# EAGLE design GB USB-C Charging Kit Pro (EAGLE 6.2)
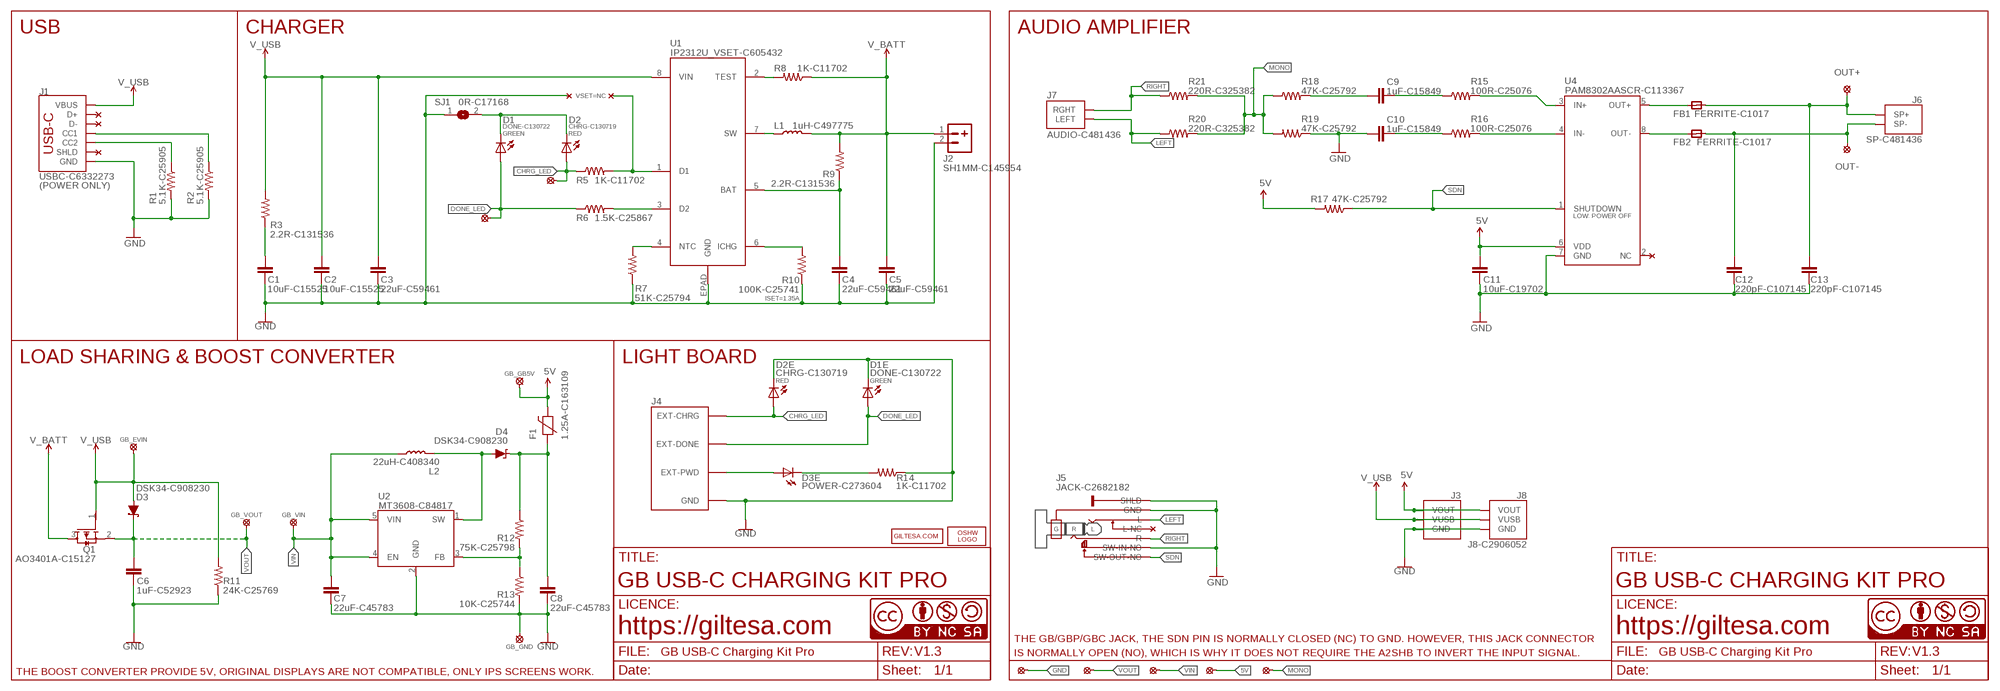
[diagram p0: schematic, sheet 1]

## Parts
C1  10uF-C15525  C0402_S  [C0402_S]
C2  10uF-C15525  C0402_S  [C0402_S]
C3  22uF-C59461  C0603_SMALL  [C0603_S]
C4  22uF-C59461  C0603_SMALL  [C0603_S]
C5  22uF-C59461  C0603_SMALL  [C0603_S]
C6  1uF-C52923  C0402_S  [C0402_S]
C7  22uF-C45783  C0805_SMALL  [C0805_S]
C8  22uF-C45783  C0805_SMALL  [C0805_S]
C9  1uF-C15849  C0603_SMALL  [C0603_S]
C10  1uF-C15849  C0603_SMALL  [C0603_S]
C11  10uF-C19702  C0603_SMALL  [C0603_S]
C12  220pF-C107145  C0805_SMALL  [C0805_S]
C13  220pF-C107145  C0805_SMALL  [C0805_S]
D1  DONE-C130722  LED_0402  [L0402]
D1E  DONE-C130722  LED_0402  [L0402]
D2  CHRG-C130719  LED_0402  [L0402]
D2E  CHRG-C130719  LED_0402  [L0402]
D3  DSK34-C908230  DIODE-SCHOTTKY_SOD-123FL  [SOD-123FL]
D3E  POWER-C273604  LED_0402  [L0402]
D4  DSK34-C908230  DIODE-SCHOTTKY_SOD-123FL  [SOD-123FL]
F1  1.25A-C163109  FUSE0603_S  [F0603_S]
FB1  FERRITE-C1017  MICROBUILDER_FERRITE_SMALL  [MICROBUILDER__0805MP_S]
FB2  FERRITE-C1017  MICROBUILDER_FERRITE_SMALL  [MICROBUILDER__0805MP_S]
GB_  POWER-C2845538  GB_DMG_JST_POWER  [GB_DMG_JST_POWER]
GBL_  LED-C481436  GB_DMG_JST_LED  [GB_DMG_JST_LED]
J1  USBC-C6332273  USB-C_16P_DADA_3MM  [USB-C_16P_3MM]
J2  SH1MM-C145954  JST-21MM  [JST-2-1MM-SMD_RIGHT]
J3  GB_DMG_BRIDGE_2.0MM_UP  [GB_DMG_BRIDGE_2.0MM_UP]
J4  GB_DMG_LED  [GB_DMG_LED]
J5  JACK-C2682182  GB_DMG_JACK  [GB_DMG_JACK]
J6  SP-C481436  GB_DMG_JST_SPEAKER  [GB_DMG_JST_SPEAKER]
J7  AUDIO-C481436  GB_DMG_JST_AUDIO  [GB_DMG_JST_AUDIO]
J8  J8-C2906052  GB_DMG_BRIDGE_2.0MM_RIGHT  [GB_DMG_BRIDGE_2.0MM_RIGHT]
L1  1uH-C497775  INDUCTOR_2  [PSPMAA0402]
L2  22uH-C408340  INDUCTOR_2  [PSPMAA0402]
LOGO2  OSHW_LOGO_FILLX0150-NT  [OSHW_FILLX150_NOTEXT]
PP1  SOLDER_PAD-1.3  [SOLDER_PAD_1.3]
PP2  SOLDER_PAD-1.3  [SOLDER_PAD_1.3]
PP3  SOLDER_PAD-1.3  [SOLDER_PAD_1.3]
PP4  SOLDER_PAD-1.3  [SOLDER_PAD_1.3]
PP6  SOLDER_PAD-1.3  [SOLDER_PAD_1.3]
Q1  AO3401A-C15127  AO3401A_SMALL  [SOT23-3_S]
R1  5.1K-C25905  R0402  [R0402]
R2  5.1K-C25905  R0402  [R0402]
R3  2.2R-C131536  R0402  [R0402]
R5  1K-C11702  R0402  [R0402]
R6  1.5K-C25867  R0402  [R0402]
R7  51K-C25794  R0402  [R0402]
R8  1K-C11702  R0402  [R0402]
R9  2.2R-C131536  R0402  [R0402]
R10  100K-C25741  R0402  [R0402]
R11  24K-C25769  R0402  [R0402]
R12  75K-C25798  R0402  [R0402]
R13  10K-C25744  R0402  [R0402]
R14  1K-C11702  R0402  [R0402]
R15  100R-C25076  R0402  [R0402]
R16  100R-C25076  R0402  [R0402]
R17  47K-C25792  R0402  [R0402]
R18  47K-C25792  R0402  [R0402]
R19  47K-C25792  R0402  [R0402]
R20  220R-C325382  R0402  [R0402]
R21  220R-C325382  R0402  [R0402]
SJ1  0R-C17168  JUMPER-SMD0402  [JUMPER-SMD_0402]
U1  IP2312U_VSET-C605432  IP2312_CUSTOM  [IP2312]
U2  MT3608-C84817  MT3608"  [SOT-23-6]
U4  PAM8302AASCR-C113367  PAM8302A_ASCR  [PAM8302AASCR]
U$6  CC-BY-NC-SA15MM  [CC-BY-NC-SA_15MM]
U$16  GILTESA.COM_MASK  [GILTESA.COM_MASK_15MM]
U$17  CC-NC-BCNIX  [CC-NC-B_NIX]
U$20  OUT+  SOLDER_PAD-1.3  [SOLDER_PAD_1.3]
U$21  CC-NC-BCNIX  [CC-NC-B_NIX]
U$23  OUT-  SOLDER_PAD-1.3  [SOLDER_PAD_1.3]

## Nets
5V: C11.1 F1.2 GB_.GB5V J3.VOUT J8.VOUT PP1.P$1 R17.2 U4.6(VDD)
CHRG_LED: D2.A D2E.A GBL_.CHRG J4.EXT-CHRG R5.1
DONE_LED: D1.A D1E.A GBL_.DONE J4.EXT-DONE R6.1
GND: C1.1 C2.1 C3.1 C4.1 C5.1 C6.2 C7.1 C8.1 C10.2 C11.2 C12.2 C13.2 D1E.C D2E.C GB_.GND J1.GND1(GND) J1.GND2(GND) J2.2 J3.GND J4.PWD-GND'(GND) J4.PWD-GND(GND) J5.1"(GND) J5.1(GND) J5.5(SW-IN-NO) J5.8'(SHLD) J5.8(SHLD) J8.GND PP2.P$1 R1.2 R2.2 R7.1 R10.1 R11.1 R13.2 R14.1 R19.1 SJ1.1 U1.EPAD(GND) U2.2(GND) U4.7(GND)
LEFT: J5.3(L) J7.LEFT R20.1
MONO: PP6.P$1 R18.1 R19.2 R20.2 R21.2
N$1: D1.C D2.C SJ1.2
N$2: C8.2 D4.C F1.1 R12.1
N$3: D4.A L2.P$2 U2.1(SW)
N$4: J1.B5-CC2(CC2) R1.1
N$6: R8.2 U1.2(TEST)
N$7: R12.2 R13.1 U2.3(FB)
N$9: R16.2 U4.4(IN-)
N$10: D3E.A J4.EXT-PWD
N$11: D3E.C R14.2
N$12: R15.2 U4.3(IN+)
N$13: J1.A5-CC1(CC1) R2.1
N$14: C4.2 R9.1 U1.5(BAT)
N$15: C1.2 R3.1
N$16: C10.1 R16.1
N$17: FB2.1 U4.8(OUT-)
N$19: R5.2 U1.1(D1)
N$22: FB1.1 U4.5(OUT+)
N$23: C9.1 R15.1
N$25: C9.2 R18.2
N$27: R7.2 U1.4(NTC)
N$28: R10.2 U1.6(ICHG)
N$29: R6.2 U1.3(D2)
N$31: L1.P$1 U1.7(SW)
OUT+: C13.1 FB1.2 J6.SP+ U$20.P$1
OUT-: C12.1 FB2.2 J6.SP- U$23.P$1
RIGHT: J5.2(R) J7.RGHT R21.1
SDN: J5.6(SW-OUT-NO) R17.1 U4.1(SHUTDOWN)
V_BATT: C5.2 J2.1 L1.P$2 Q1.3(D) R8.1 R9.2
V_USB: C2.2 C3.2 D3.A GB_.EVIN J1.VBUS1(VBUS) J1.VBUS2(VBUS) J3.VUSB J8.VUSB Q1.1(G) R3.2 R11.2 U1.8(VIN)
VIN: C7.2 GB_.VIN L2.P$1 PP3.P$1 U2.4(EN) U2.5(VIN)
VOUT: C6.1 D3.C GB_.VOUT PP4.P$1 Q1.2(S)
Unconnected: J1.A6-DP1(D+) J1.A7-DN1(D-) J1.B6-DP2(D+) J1.B7-DN2(D-) J1.SHLD1(SHLD) J1.SHLD2(SHLD) J1.SHLD3(SHLD) J1.SHLD4(SHLD) J5.4(L-NC) U4.2(NC)

## Notes on the sheet
- USB | CHARGER | AUDIO AMPLIFIER
- VSET=NC
- GREEN | RED
- (POWER ONLY)
- ISET=1.35A
- LOAD SHARING & BOOST CONVERTER | LIGHT BOARD
- RED | GREEN
- GB USB-C CHARGING KIT PRO | GB USB-C CHARGING KIT PRO
- https://giltesa.com | https://giltesa.com
- THE GB/GBP/GBC JACK, THE SDN PIN IS NORMALLY CLOSED (NC) TO GND. HOWEVER, THIS JACK CONNECTOR
- V1.3 | IS NORMALLY OPEN (NO), WHICH IS WHY IT DOES NOT REQUIRE THE A2SHB TO INVERT THE INPUT SIGNAL. | V1.3
- THE BOOST CONVERTER PROVIDE 5V, ORIGINAL DISPLAYS ARE NOT COMPATIBLE, ONLY IPS SCREENS WORK.

## Library data of the parts
C1 C2 C6 = ,giltesa:C0402
C3-C5 C9-C11 = ,giltesa:C0603
C7 C8 C12 C13 = ,giltesa:C0805
D1 D1E D2 D2E D3E = ,giltesa:LED
D3 D4 = ,giltesa:DIODE-SCHOTTKY
F1 = ,giltesa:FUSE
FB1 FB2 = microbuilder:MICROBUILDER_FERRITE: Ferrite Bead 0603 MMZ1608B121C - 120 Ohm @ 100MHz, 600mA, 0.15 Ohm DC Resistance - Digikey: 445-2164-1-ND BK1608HW121-T - 120 Ohm, 600mA Ferrite Chip - Digikey: 587-1876-2-ND 0805 HZ0805B272R-10 - 2.7K Ohm @ 100MHz, 200mA, 0.8 Ohm DC Resistance - Digikey: 240-2504-1-ND (see also Murata BLM21BD272SN1L) MMZ2012Y152B - 1.5K Ohm @ 100MHz, 500mA, 0.4 Ohm DC Resistance - Digikey: 445-1560-1-ND - Mainly for high frequency (80-400MHz) MMZ2012R102A - 1K Ohm @ 100MHz, 500mA, 0.3 Ohm DC Resistance - Digikey: 445-1555-2-ND - More general purpose (10-200MHz)
GB_ = ,giltesa:GB_DMG_JST_POWER
GBL_ = ,giltesa:GB_DMG_JST_LED
J1 = ,giltesa:USB-C_16P
J2 = ,giltesa:JST-2
J3 J8 = ,giltesa:GB_DMG_BRIDGE
J4 = ,giltesa:GB_DMG_LED
J5 = ,giltesa:GB_DMG_JACK
J6 = ,giltesa:GB_DMG_JST_SPEAKER
J7 = ,giltesa:GB_DMG_JST_AUDIO
L1 L2 = ,giltesa:INDUCTOR
LOGO2 = ohw-logo:OSHW_LOGO_FILL
PP1-PP4 PP6 U$20 U$23 = ,giltesa:SOLDER_PAD
Q1 = ,giltesa:AO3401A
R1-R3 R5-R21 = ,giltesa:R0402
SJ1 = ,giltesa:JUMPER-SMD
U1 = ,giltesa:IP2312
U2 = ,giltesa:MT3608
U4 = ,giltesa:PAM8302A
U$6 = ,giltesa_logos:CC-BY-NC-SA
U$16 = ,giltesa_logos:GILTESA.COM
U$17 U$21 = cc-by-nc-sa:CC-NC-BC: All hardware is licensed under the Creative Commons Attribution-Noncommercial-Share Alike 2.5 Switzerland License. To view a copy of this license, visit http://creativecommons.org/licenses/by-nc-sa/2.5/ch/ or send a letter to Creative Commons, 171 Second Street, Suite 300, San Francisco, California, 94105, USA.

## Net classes
1 power: width 0.61 mm, drill 0.406 mm, clearance 0.203 mm
2 gnd: width 0.305 mm, drill 0.406 mm, clearance 0.203 mm
3 power usb: width 0.508 mm, drill 0.406 mm, clearance 0.203 mm

## Board
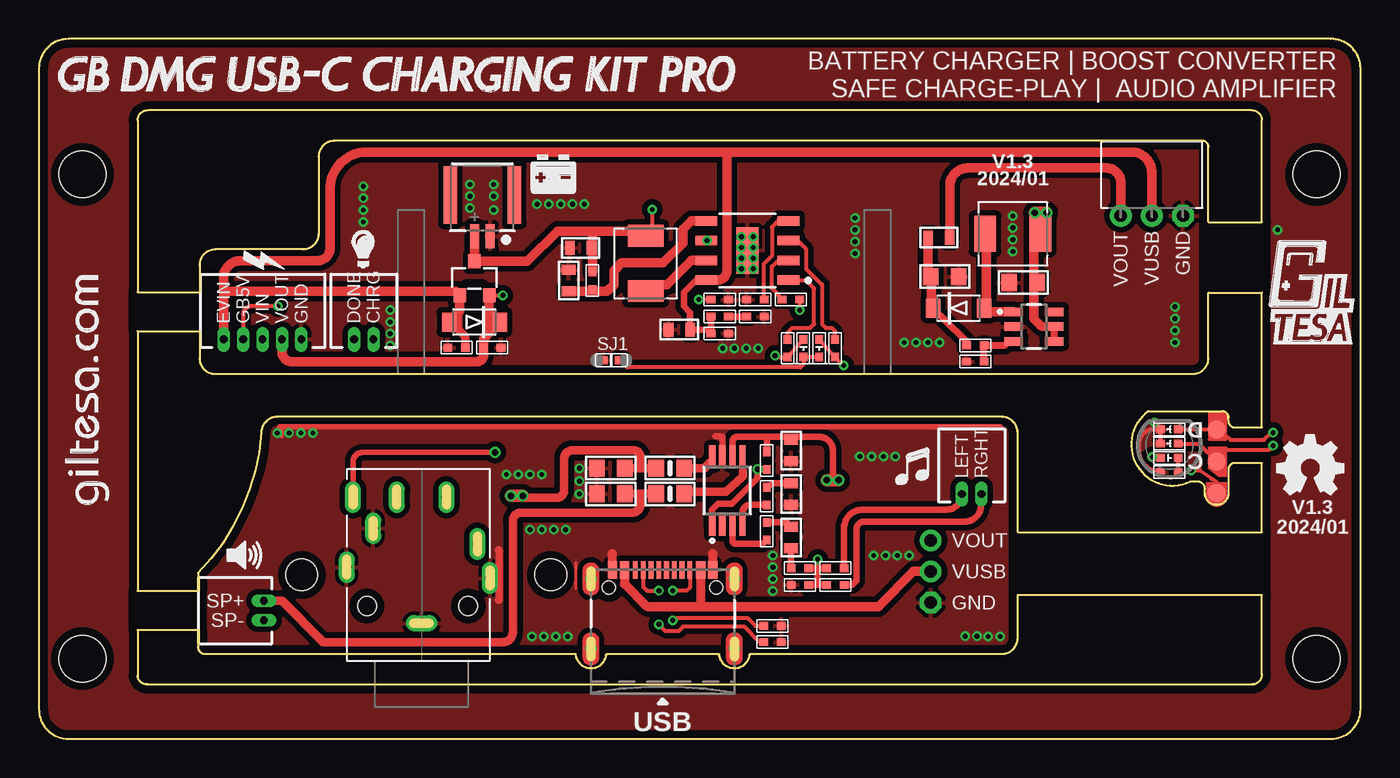
[diagram p1: board, top side]
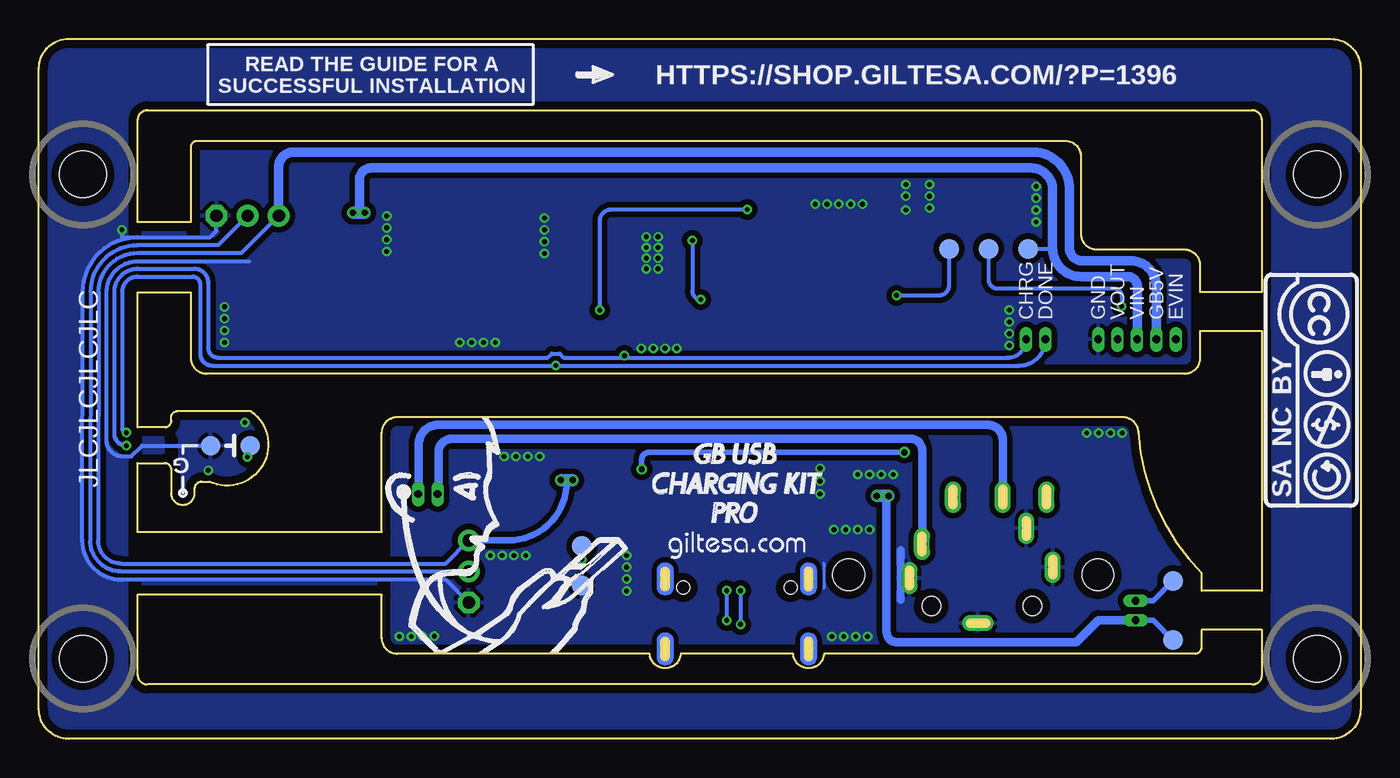
[diagram p2: board, bottom side, seen from below]

Size 85 x 45 mm. Coordinates in mm from the lower left corner, seen from the top.
Outline: 74.52,16.54 74.03,16.54 arc-170 71.35,21.07 76.12,21.07 arc-90 76.5,20.63 76.5,20.47 arc90 76.87,20.02 78.65,20.02 78.65,28.68 75.21,28.68 75.21,24.48 arc-90 74.2,23.46 11.34,23.46 arc-90 10.33,24.48 10.33,26.21 6.35,26.21 6.35,9.51 10.24,9.51 10.24,10.67 arc40 14.31,19.68 arc-90 15.32,20.7 61.93,20.7 arc-90 62.95,19.68 62.95,13.29 78.65,13.29 78.65,17.73 76.95,17.73 arc90 76.5,17.36 76.5,15.8 arc-180 74.98,15.8 74.98,16.08 arc90 74.52,16.54
Outline: 1.91,0 83.07,0 arc90 85,1.91 85,43.1 arc90 83.07,45 1.91,45 arc90 0,43.1 0,1.91 arc90 1.91,0
Outline: 75.21,33.23 75.21,38.07 arc90 74.83,38.45 19,38.45 arc90 17.99,37.43 17.99,32.48 arc-90 16.97,31.46 11.34,31.46 arc90 10.33,30.45 10.33,28.72 6.35,28.72 6.35,39.77 arc-90 6.99,40.41 78.02,40.41 arc-90 78.65,39.77 78.65,33.23 75.21,33.23
Outline: 10.24,7 10.24,5.97 arc90 10.62,5.46 34.5,5.46 arc170 36.5,5.46 43.72,5.46 arc170 45.72,5.46 61.93,5.46 arc90 62.95,6.48 62.95,9.25 78.65,9.25 78.65,4.13 arc-90 78.02,3.5 6.99,3.5 arc-90 6.35,4.06 6.35,7 10.24,7
Copper layers (1*16): Top 0.035mm / dielectric 1.6mm / Bottom 0.035mm
Design rules: minimum track width 6mil, minimum drill 12mil, track to track 6mil, track to pad 6mil, pad to pad 6mil, via to via 8mil, smd to smd 0mil, copper to edge 20mil, drill to drill 10mil, minimum pad ring 6mil, minimum via ring 6mil, stop-mask expansion 0mil, vias tented up to drill 100mil, thermal gap 10mil
Holes 3 mm at 82.17,36.29 2.8,36.29 2.8,5.16 82.17,5.16
tKeepout: area 22.8,23.5 to 25,38.4; area 52.8,23.5 to 55,38.4
tRestrict: 11 lines
bRestrict: 10 lines

### Footprints (pad centres in the part's own frame; a part is rotated, then mirrored left to right if it is on the bottom)
C0402_S = smd 0.559 x 0.5: 1 -0.567,0; 2 0.567,0
C0603_S = smd 0.635 x 0.9: 1 -0.694,0; 2 0.694,0
C0805_S = smd 1 x 1.1: 1 -0.901,0; 2 0.901,0
L0402 = smd 0.559 x 0.5: A 0.567,0; C -0.567,0
SOD-123FL = smd 0.91 x 1.22: A 1.637,0; C -1.637,0
F0603_S = smd 0.635 x 0.9: 1 -0.694,0; 2 0.694,0
MICROBUILDER__0805MP_S = smd 1 x 1.1: 1 -0.901,0; 2 0.901,0
GB_DMG_JST_POWER = drill 0.5 long: EVIN 2.5,0; GB5V 1.25,0; GND -2.5,0; VIN 0,0; VOUT -1.25,0 | smd 0.127 x 0.127: NA 2.5,-0.256
GB_DMG_JST_LED = drill 0.5 long: CHRG -0.625,0; DONE 0.625,0 | smd 0.127 x 0.127: NA 0.625,-0.256
USB-C_16P_3MM = smd 0.3 x 1.143: A5-CC1 -1.25,2.732; A6-DP1 -0.25,2.732; A7-DN1 0.25,2.732; A8-SBU1 1.25,2.732; B5-CC2 1.75,2.732; B6-DP2 0.75,2.732; B7-DN2 -0.75,2.732; B8-SBU2 -1.75,2.732 | smd 0.6 x 1.143: GND1 -3.225,2.732; GND2 3.225,2.732; VBUS1 -2.45,2.732; VBUS2 2.45,2.732 | drill 0.4 pad 0.6: SHLD1 -4.61,2.16; SHLD2 4.61,2.16; SHLD3 -4.61,-2.34; SHLD4 4.61,-2.34 | hole 0.838: -3.45,1.6; 3.45,1.6
JST-2-1MM-SMD_RIGHT = smd 0.6 x 1.524: 1 -0.5,-2.017; 2 0.5,-2.017 | smd 0.889 x 3.683: NC1 -2.054,0.635; NC2 2.054,0.635
GB_DMG_BRIDGE_2.0MM_UP = drill 0.8 pad 1.397 octagon: GND 2,0 | smd 0.127 x 0.127: NA -2,0.256 | drill 0.8 pad 1.397: VOUT -2,0; VUSB 0,0
GB_DMG_LED = smd 1.143 x 1.143: EXT-CHRG -3.048,1.016; EXT-DONE -3.048,-1.016; PWD-GND' -3.048,3.048 | smd 1.27 x 1.27 bottom: EXT-PWD 1.27,0; PWD-GND -1.27,0
GB_DMG_JACK = drill 0.6 pad 1.016 long: 1 0,2.4; 2 -1.6,10.5; 3 3.6,7.5; 4 1.6,10.5; 5 -3.1,8.5; 6 -4.4,10.5; 8 4.4,5.3; 8' -4.8,6 | smd 0.127 x 0.127: 1" 0,2.796 | hole 2.032: -7.704,5.512; 8.311,5.512 | hole 1.2: -3.5,3.5; 3,3.5
GB_DMG_JST_SPEAKER = smd 0.127 x 0.127: NA 0.625,-0.256 | drill 0.5 long: SP+ -0.625,0; SP- 0.625,0
GB_DMG_JST_AUDIO = drill 0.5 long: LEFT 0.625,0; RGHT -0.625,0 | smd 0.127 x 0.127: NA 0.625,-0.256
GB_DMG_BRIDGE_2.0MM_RIGHT = drill 0.8 pad 1.397 octagon: GND -2,0 | smd 0.127 x 0.127: NA 2,-0.256 | drill 0.8 pad 1.397: VOUT 2,0; VUSB 0,0
PSPMAA0402 = smd 1.4 x 2.3: P$1 -1.775,0; P$2 1.775,0
SOLDER_PAD_1.3 = smd 1.3 x 1.3: P$1 0,0
SOT23-3_S = smd 0.8 x 0.9: 1 -0.95,-1.076; 2 0.95,-1.076; 3 0,1.1
R0402 = smd 0.559 x 0.5: 1 -0.567,0; 2 0.567,0
JUMPER-SMD_0402 = smd 0.635 x 0.5: 1 -0.559,0; 2 0.559,0
IP2312 = smd 1.4 x 0.6: 1 -2.65,1.905; 2 -2.65,0.635; 3 -2.65,-0.635; 4 -2.65,-1.905; 5 2.65,-1.905; 6 2.65,-0.635; 7 2.65,0.635; 8 2.65,1.905 | smd 1.4 x 3: EPAD 0,0
SOT-23-6 = smd 0.55 x 1.2: 1 -0.95,-1.3; 2 0,-1.3; 3 0.95,-1.3; 4 0.95,1.3; 5 0,1.3; 6 -0.95,1.3
PAM8302AASCR = smd 0.4 x 1.4: 1 -0.975,-2.2; 2 -0.325,-2.2; 3 0.325,-2.2; 4 0.975,-2.2; 5 0.975,2.2; 6 0.325,2.2; 7 -0.325,2.2; 8 -0.975,2.2

### Placement (x,y rotation side)
C1  46.07,27.15 180 top
C2  43.78,26.07 180 top
C3  41.19,26.32 0 top
C4  34.07,29.47 270 top
C5  34.84,31.57 0 top
C6  29.15,25.15 0 top
C7  63.3,29.34 0 top
C8  58.26,29.72 180 top
C9  48.37,12.95 270 top
C10  48.37,15.75 270 top
C11  48.37,18.54 270 top
C12  36.78,17.41 180 top
C13  36.78,15.76 180 top
D1  50.18,25.11 90 top
D1E  72.69,19.9 0 top
D2  49.16,25.11 90 top
D2E  72.69,18.98 0 top
D3  28.01,26.8 180 top
D3E  72.69,18.07 180 top
D4  59.15,27.69 0 top
F1  57.88,32.22 0 top
FB1  40.59,15.76 180 top
FB2  40.59,17.41 180 top
GB_  14.38,25.68 180 top
GBL_  20.89,25.68 180 top
J1  40.11,8.13 0 top
J2  28.52,34.33 0 top
J3  57.36,10.76 270 top
J4  72.69,18.86 180 top
J5  24.61,5.04 0 top
J6  14.48,8.26 270 top
J7  59.98,15.74 180 top
J8  71.57,33.63 180 top
L1  39.03,30.57 90 top
L2  62.63,32.47 180 top
LOGO2  79.63,15.71 0 top
PP1  23.92,31.5 0 bottom
PP2  50.08,9.86 0 bottom
PP3  21.38,31.5 0 bottom
PP4  26.46,31.5 0 bottom
PP6  50.08,12.4 0 bottom
Q1  28.01,29.59 0 top
R1  47.18,7.27 0 top
R2  47.18,6.23 0 top
R3  43.78,27.15 180 top
R5  48.15,25.11 90 top
R6  51.2,25.11 90 top
R7  46.07,28.24 0 top
R8  48.36,28.24 180 top
R9  35.6,29.47 90 top
R10  43.78,28.24 180 top
R11  26.87,25.15 0 top
R12  60.22,25.3 0 top
R13  60.22,24.26 180 top
R14  72.69,17.16 0 top
R15  46.81,13.35 270 top
R16  46.81,15.61 270 top
R17  46.81,17.89 90 top
R18  48.95,10.98 180 top
R19  48.95,9.89 0 top
R20  51.22,10.98 180 top
R21  51.22,9.89 180 top
SJ1  36.82,24.34 0 top
U1  45.56,31.4 180 top
U2  63.99,26.5 270 top
U4  44.27,15.97 0 top
U$1  [SPEAKER]  12.7,11.81 0 top
U$4  [BATTERY]  31.56,35.05 0 top
U$6  6.22,29.97 270 bottom
U$7  [GAME_BOY_DMG]  1.3,41.57 0 top
U$8  [LIGHT]  20.07,30.23 0 top
U$9  [GILTESA_LOGO_MASK_7MM]  78.49,25.27 0 top
U$10  [SOUND]  54.99,16.26 0 top
U$13  [GB_DMG_BOARD_LOGO]  62.76,5.46 0 bottom
U$14  [POWER]  13.08,29.97 0 top
U$15  [GILTESA.COM_MASK_9MM]  40.11,12.45 0 bottom
U$16  4.62,14.96 90 top
U$17  0,0 0 top
U$20  12.06,10.16 0 bottom
U$21  0,0 0 top
U$23  12.06,6.35 0 bottom
U$34  [GB_DMG_BOARD]  40.11,16.45 0 bottom

### Tracks (layer width: path | path; a pad name or v marks a point on that pad's centre or on a via)
5V  (via drill 0.3, 0.41)
  Top 0.254: v15.37,27.81 13.64,27.81 arc90 13.13,27.3 GB_.GB5V
  Top 0.406: U4.6 44.6,19.11 arc-90 44.91,19.42 46.94,19.42 | 46.94,19.42 46.81,19.29 R17.2 | v51.44,16.64 51.05,16.64 | 48.43,19.18 C11.1 48.37,19.4 48.39,19.42 | 46.94,19.42 48.39,19.42 | 48.39,19.42 50.18,19.42 arc-90 51.05,18.54 51.05,16.64 | 51.05,16.64 v50.67,16.64
  Top 0.61: F1.2 58.57,35.52 arc-90 59.75,36.7 68.65,36.7 arc-90 69.57,35.78 J8.VOUT
  Top 0.813: v51.44,16.64 v50.67,16.64
  Bottom 0.254: J8.VOUT 71.96,31.24 78.65,31.24 arc-90 81.15,28.74 81.19,12.74 arc-90 79.71,11.27 58.85,11.27 J3.VOUT | 15.37,28.07 v15.37,27.81 15.37,28.45 arc-90 15.88,28.96 23.37,28.96 arc90 23.92,29.51 PP1.P$1
  Bottom 0.406: J3.VOUT 54.8,12.76 arc-90 51.05,16.51 51.05,16.64 v50.67,16.64
  Bottom 0.61: J8.VOUT 69.57,36.78 arc90 68.64,37.72 21.02,37.72 arc90 18.73,35.31 18.73,31.56 arc-90 17.91,30.73 14.78,30.73 arc90 13.13,29.08 GB_.GB5V
  Bottom 0.813: v50.67,16.64 v51.44,16.64
CHRG_LED  (via drill 0.3)
  Top 0.254: D2E.A 74.6,18.98 J4.EXT-CHRG 76.38,18.59 79.12,18.59 v79.38,18.85 | D2.A R5.1 48.11,24.51 47.47,24.51 v47.34,24.64
  Bottom 0.254: v79.38,18.85 arc90 80.14,19.61 80.14,28.74 arc90 78.65,30.23 75,30.23 arc90 74.11,29.34 74.11,25.15 arc-90 73.48,24.51 52.27,24.51 52.01,24.77 51.51,24.77 51.25,24.51 47.47,24.51 v47.34,24.64 47.34,24.61 47.24,24.51 22.69,24.51 arc-90 GBL_.CHRG
DONE_LED  (via drill 0.3)
  Top 0.254: D1E.A 75.72,19.9 J4.EXT-DONE 76.65,19.22 78.78,19.22 79.25,19.68 v79.38,19.68 | D1.A R6.1 51.74,24 v51.76,24
  Bottom 0.254: v79.38,19.68 arc90 79.63,19.94 79.63,28.74 arc90 78.65,29.72 75.13,29.72 arc90 74.62,29.21 74.62,24.77 arc-90 73.86,24 v51.76,24 21.95,24 arc-90 GBL_.DONE
GND  (via drill 0.3)
  Top 0.203: 34.52,11.3 34.52,9.65
  Top 0.254: 15.62,20.07 15.62,19.43 | D1E.C 72.12,19.95 | R14.1 71.87,17.16 arc-70 70.74,18.54 70.74,18.92 arc-90 71.72,19.9 D1E.C | D1E.C D2E.C | v71.75,20.33 71.75,20.27 arc90 D1E.C | J4.PWD-GND' 75.74,16.49 75.42,16.72 74.64,17.25 74.64,17.26 v74.11,17.26
  Top 0.356: 15.49,20.07 15.62,20.07 61.85,20.07
  Top 0.406: U4.7 43.95,19.44 43.77,19.46 43.51,19.46
  Top 0.508: 29.59,12.14 29.59,8.91
  Top 0.584: 36.89,10.78 36.89,11.93 | 43.34,10.78 43.34,11.93
  Bottom 0.203: 34.52,11.3 34.52,9.65
  Bottom 0.254: 78.65,32.26 73.97,32.26 73.59,32.64 73.59,33.61 J8.GND | 78.65,32.26 arc-90 82.17,28.74 82.2,12.74 arc-90 79.68,10.22 58.81,10.22 J3.GND | 71.47,30.7 78.65,30.7 arc-90 80.64,28.7 80.64,19.18 arc-90 79.63,18.16 79.06,18.16 78.36,18.86 J4.PWD-GND | v79.66,32.73 79.66,32.26 78.65,32.26
  Bottom 0.508: 29.59,12.14 29.59,8.91
  other vias: 31.71,6.59 62.63,32.09 62.63,32.85 62.63,33.62 62.63,31.33 45.94,30.22 45.18,30.22 45.94,30.91 45.18,30.91 45.18,31.59 45.94,31.59 45.94,32.28 45.18,32.28 32.8,34.38 33.56,34.38 34.32,34.38 35.08,34.38 22.59,25.28 52.49,33.49 73.06,25.49 73.06,26.25 73.06,27.01 73.06,27.77 57.93,25.49 57.17,25.49 56.41,25.49 55.65,25.49 46.26,25.11 45.49,25.11 44.73,25.11 43.97,25.11 55.97,11.8 55.21,11.8 54.45,11.8 53.68,11.8 61.81,6.59 61.05,6.59 60.33,6.6 59.56,6.6 52.49,32.73 52.49,31.96 52.49,31.2 22.59,26.05 22.59,26.81 22.59,27.57 20.86,35.52 20.86,34.76 20.86,34 20.86,33.23 27.72,35.65 27.72,34.88 27.72,34.12 29.25,35.65 29.25,34.88 29.25,34 15.33,19.67 16.09,19.67 16.85,19.67 17.62,19.67 32.48,6.59 33.24,6.59 34,6.59 47.21,11.8 47.21,11.04 47.21,10.27 47.21,9.51 53.56,18.15 54.32,18.15 55.08,18.15 52.8,18.15 32.03,34.38 34.76,17.39 34.76,16.57 34.76,15.74 32.35,17 31.59,17 30.82,17 30.06,17 31.59,13.45 32.35,13.45 33.11,13.45 33.87,13.45
  pour Top (isolate 0.356): -2,47 86.97,47 86.97,-2 -2,-2
  pour Bottom (isolate 0.356): -2,47 86.97,47 86.97,-2 -2,-2
LEFT
  Top 0.406: R20.1 51.78,13.56 arc-90 52.96,14.73 58.35,14.73 arc90 J7.LEFT
  Bottom 0.559: J5.3 28.19,12.55 28.19,18.54 arc-90 28.96,19.3 58.42,19.3 arc-90 59.31,18.41 59.31,15.29 J7.LEFT
MONO  (via drill 0.3)
  Top 0.254: v50.08,11.54 50.08,10.79
  Top 0.406: R18.1 50.08,10.98 | 50.08,10.98 R20.2 | R19.2 50.08,9.89 | R21.2 50.08,9.89 | 50.08,9.89 50.08,10.79 50.08,10.98
  Bottom 0.254: PP6.P$1 v50.08,11.54
N$1
  Top 0.254: D1.C D2.C 49.16,24.08 48.97,23.88 37.85,23.88 SJ1.2
N$2
  Top 0.457: R12.1 59.65,25.55 58.28,26.92 58.27,26.92 D4.C
  Top 0.61: D4.C 57.4,27.79 57.4,29.72 C8.2 57.19,29.89 F1.1
N$3
  Top 0.61: D4.A 60.66,27.4 60.82,27.56 | L2.P$2 60.82,32.43 60.9,32.43 60.95,32.38 60.95,27.47 D4.A | U2.1 60.81,27.45 D4.A
N$4  (via drill 0.3)
  Top 0.254: v40.77,7.62 40.89,7.75 45.59,7.75 46.07,7.27 R1.1 | J1.B5-CC2 41.86,9.73 41.66,9.53 v40.77,9.53
  Bottom 0.254: v40.77,9.53 v40.77,7.62
N$6
  Top 0.254: U1.2 48.19,30.73 47.52,30.73 47.14,30.35 47.14,28.96 47.79,28.3 R8.2
N$7
  Top 0.457: R13.1 R12.2 62.12,25.3 62.37,25.55 U2.3
N$9
  Top 0.406: R16.2 45.74,15.04 arc90 45.25,14.55 U4.4
N$10  (via drill 0.3)
  Top 0.254: v71.59,18.12 72.12,18.12 D3E.A
  Bottom 0.254: v71.59,18.12 71.59,18.69 J4.EXT-PWD
N$11
  Top 0.254: D3E.C R14.2
N$12
  Top 0.406: R15.2 46.78,12.78 46.56,12.56 44.78,12.56 arc-90 44.6,12.74 U4.3
N$13  (via drill 0.3)
  Top 0.254: R2.1 46.35,6.23 45.34,7.24 41.45,7.24 41.15,6.93 40.31,6.93 v39.88,7.37 | J1.A5-CC1 38.86,9.78 39.12,9.53 v39.88,9.53
  Bottom 0.254: v39.88,9.53 v39.88,7.37
N$14
  Top 0.254: R9.1 35.71,28.9 35.71,28.77
  Top 0.61: U1.5 41.96,33.3 41.42,32.77 41.42,31.88 40.15,30.61 37.48,30.61 36.98,30.1 36.98,29.21 36.54,28.77 35.71,28.77 C4.2
N$15
  Top 0.406: R3.1 C1.2
N$16
  Top 0.406: C10.1 47.21,16.44 R16.1
N$17
  Top 0.406: U4.8 43.3,17.9 43.18,17.78
  Top 0.559: 41.66,17.41 FB2.1 42.81,17.41 43.18,17.78
N$19
  Top 0.254: U1.1 49.32,29.49 49.85,28.96 49.85,26.67 49.6,26.42 48.46,26.42 48.15,26.11 R5.2
N$22
  Top 0.406: U4.5 45.25,17.31 45.28,17.21
  Top 0.559: 45.28,17.21 45.28,16.89 44.2,15.88 41.61,15.88 FB1.1
N$23
  Top 0.406: R15.1 48.1,13.91 C9.1
N$25
  Top 0.406: R18.2 C9.2
N$27
  Top 0.254: U1.4 47.55,33.3 47.14,32.89 47.14,31.05 46.63,30.54 46.63,28.25 R7.2
N$28  (via drill 0.3)
  Top 0.254: R10.2 v42.44,28.25 | v42.97,32.03 U1.6
  Bottom 0.254: v42.97,32.03 42.97,28.78 arc-90 v42.44,28.25
N$29
  Top 0.254: U1.3 48.81,32.03 49.35,31.5 49.35,30.23 50.36,29.21 50.36,26.67 50.62,26.42 51,26.42 51.2,26.22 R6.2
N$31
  Top 0.61: U1.7 41.96,30.76 40.41,29.21 39.52,29.21 39.1,28.92 L1.P$1
OUT+
  Top 0.559: C13.1 38.69,15.76 | 38.69,15.76 FB1.2 | 38.69,15.76 38.69,15.06 arc-90 38.18,14.55 31.02,14.55 arc90 30.48,14.01 30.48,6.86 arc-90 29.84,6.22 18.29,6.22 15.63,8.88 J6.SP+
  Bottom 0.356: J6.SP+ 13.35,8.88 U$20.P$1
OUT-  (via drill 0.41)
  Top 0.559: 30.88,15.61 v31.11,15.62 31.24,15.49 33.27,15.49 arc90 33.78,16 33.78,18.03 arc-90 34.3,18.55 38.25,18.55 arc-90 38.69,18.11 38.69,17.41 | FB2.2 FB2.2 arc90 FB2.2 38.69,17.41 | C12.1 38.69,17.41
  Top 0.813: v30.35,15.62 v31.11,15.62
  Bottom 0.356: J6.SP- 13.35,7.63 U$23.P$1
  Bottom 0.559: v30.35,15.62 30.48,15.49 30.48,6.86 arc-90 29.84,6.22 18.29,6.22 16.88,7.63 J6.SP-
  Bottom 0.813: v31.11,15.62 v30.35,15.62
RIGHT
  Top 0.406: R21.1 52.31,9.89 52.58,10.16 52.58,13.46 arc-90 53.09,13.97 59.56,13.97 arc90 60.58,14.99 60.58,15.21 arc-90 J7.RGHT
  Bottom 0.559: J5.2 23.01,19.2 arc-90 24,20.19 59.31,20.19 arc-90 60.58,18.92 60.58,15.27 arc90 J7.RGHT
SDN  (via drill 0.36, 0.41)
  Top 0.305: v46.24,17.33 arc-90 v46.23,17.33
  Top 0.356: 20.19,15.55 arc90 J5.6 arc-90 20.19,15.55 | v29.34,18.41 20.83,18.41 arc90 20.19,17.78 20.19,15.55
  Top 0.406: U4.1 43.3,14.72 43.69,15.11 44.58,15.11 46.23,16.76 v46.23,17.33 v46.24,17.33 R17.1
  Bottom 0.356: v29.34,18.41 45.77,18.41 arc-90 46.23,17.96 v46.23,17.33
V_BATT  (via drill 0.3)
  Top 0.254: R8.1 v48.92,27.56 | v39.44,34.04 39.44,32.75 L1.P$2
  Top 0.61: J2.1 28.02,30.7 | 28.02,30.7 Q1.3 | 28.02,30.7 31.41,30.7 33.34,32.64 35.63,32.64 | 35.63,32.64 38.73,32.64 L1.P$2 | R9.2 35.6,31.62 | 35.6,31.62 35.6,32.61 35.63,32.64 | C5.2 35.54,31.57 35.6,31.62
  Bottom 0.254: v48.92,27.56 48.92,33.27 arc90 48.2,34.04 v39.44,34.04
V_USB
  Top 0.406: 42.16,8.56 42.22,8.51 | U1.8 42.26,29.49 41.47,28.7 41.47,27.81 41.89,27.4 C3.2 43.22,26.32 | R3.2 C2.2
  Top 0.508: R11.2 27.43,25.85 26.99,26.29 26.99,27.49 27.06,27.56 | 43.22,26.32 C2.2
  Top 0.559: 42.56,8.53 42.55,8.51
  Top 0.584: U1.8 43.63,29.49 | J1.VBUS2 42.56,8.53 | J1.VBUS1 37.66,9.96 39.12,8.51 39.37,8.51
  Top 0.61: 39.37,8.51 42.22,8.51 42.55,8.51 53.98,8.51 56.23,10.76 J3.VUSB | 44.24,37.72 21.02,37.72 arc90 18.73,35.31 18.73,31.56 arc-90 17.91,30.73 12.95,30.73 arc90 11.88,29.66 11.88,28.7 | 44.24,37.72 70.29,37.72 arc-90 71.56,36.45 71.56,33.65 J8.VUSB | D3.A 27.06,27.48 27.06,27.56 Q1.1 26.81,28.77 11.95,28.77 11.88,28.7 | 43.63,29.49 arc90 44.24,30.1 44.24,37.72 | GB_.EVIN 11.88,28.7
  Bottom 0.254: J3.VUSB 79.71,10.76 arc90 81.69,12.74 81.66,28.74 arc90 78.65,31.75 73.45,31.75 J8.VUSB
VIN  (via drill 0.41)
  Top 0.457: U2.4 U2.5
  Top 0.546: U2.5 64.49,26.5
  Top 0.559: 64.49,26.5 63.99,27
  Top 0.61: C7.2 64.12,29.34 63.99,28.83 | 63.99,28.83 63.99,27 64.45,26.54 | 63.99,28.83 63.99,33.77 v64.05,33.82 arc-90 64.41,33.46 L2.P$1
  Top 0.813: v64.81,33.82 v64.05,33.82
  Bottom 0.254: PP3.P$1 19.68,31.5 19.68,31.43 19.81,31.56
  Bottom 0.61: GB_.VIN 14.35,25.71 14.35,29.08 arc-90 14.99,29.72 17.97,29.72 arc90 19.81,31.56 19.81,35.43 arc-85 21.21,36.7 63.63,36.7 arc-90 64.39,35.94 64.39,34.16 arc-90 v64.05,33.82
  Bottom 0.813: v64.05,33.82 v64.81,33.82
VOUT  (via drill 0.3)
  Top 0.254: Q1.2 v29.84,28.52
  Top 0.61: Q1.2 28.96,27.56 | 28.96,27.56 28.96,27.48 D3.C | 28.96,27.56 29.03,27.49 29.03,26.16 28.6,25.73 28.59,25.73 C6.1 28.59,24.65 arc-90 28.19,24.26 16.26,24.26 arc-90 15.63,24.88 GB_.VOUT
  Bottom 0.254: v29.84,28.52 27.11,28.52 arc-90 26.46,29.16 PP4.P$1

### Text on the board
tPlace: BATTERY CHARGER | BOOST CONVERTER | SAFE CHARGE-PLAY | AUDIO AMPLIFIER | V1.3 | 2024/01 | SJ1 | V1.3 | 2024/01 | USB
bPlace: HTTPS://SHOP.GILTESA.COM/?P=1396 | READ THE GUIDE FOR A | SUCCESSFUL INSTALLATION | JLCJLCJLCJLC